# Altium project FlightController.PrjPcb (part 2 of 2)

## Sheet PSU.SchDoc
size A3; SheetNumber: 12; SheetTotal: 12
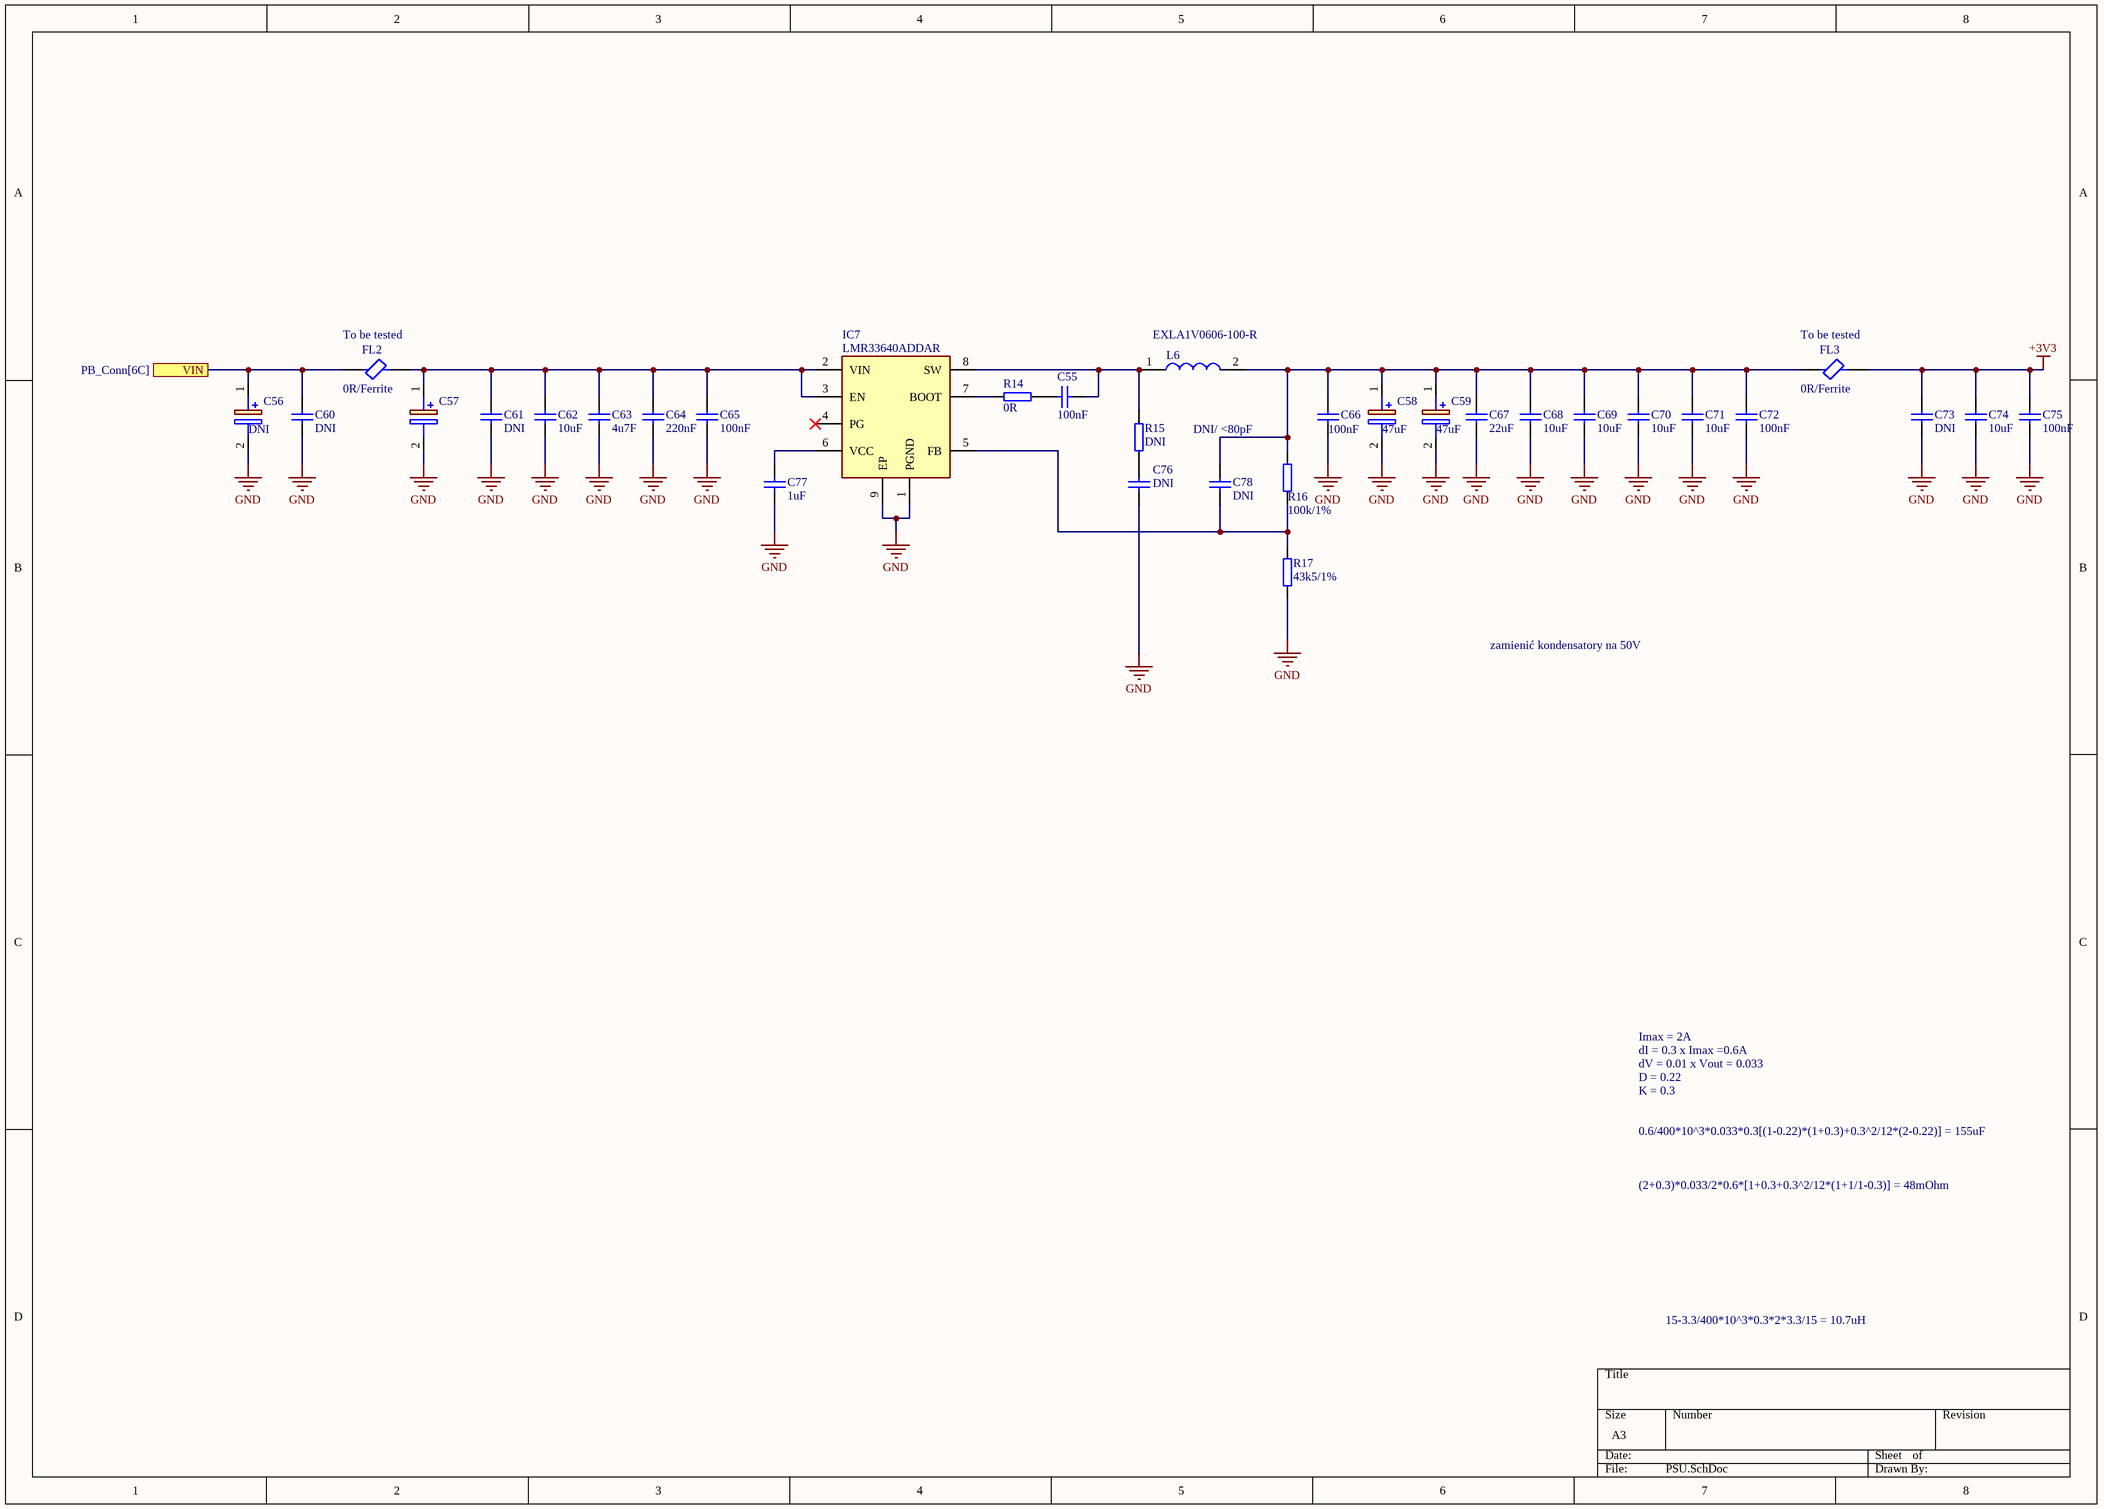
[diagram p12: PSU.SchDoc]

### Parts
(Parts that share a designator on the sheet are numbered #1, #2 ... from top to bottom, then left to right.)
C55  value 100nF  [CAP0402]  (hidden comment: Cap0402)
C56  value DNI  [CAPPM7343X310N]  (hidden comment: TR3D336K025D0200)
C57  TR3D336K025D0200  [CAPPM7343X310N]  (value not drawn)
C58  value 47uF  [CAPPC2012X90N]  (hidden comment: T58W9476M6R3C0200)
C59  value 47uF  [CAPPC2012X90N]  (hidden comment: T58W9476M6R3C0200)
C60  value DNI  [CAP0805]  (hidden comment: Cap0805)
C61  value DNI  [CAP0805]  (hidden comment: Cap0805)
C62  value 10uF  [CAP0805]  (hidden comment: Cap0805)
C63  value 4u7F  [CAP0805]  (hidden comment: Cap0805)
C64  value 220nF  [CAP0402]  (hidden comment: Cap0402)
C65  value 100nF  [CAP0402]  (hidden comment: Cap0402)
C66  value 100nF  [CAP0402]  (hidden comment: Cap0402)
C67  value 22uF  [CAP0805]  (hidden comment: Cap0805)
C68  value 10uF  [CAP0603]  (hidden comment: Cap0603)
C69  value 10uF  [CAP0603]  (hidden comment: Cap0603)
C70  value 10uF  [CAP0603]  (hidden comment: Cap0603)
C71  value 10uF  [CAP0603]  (hidden comment: Cap0603)
C72  value 100nF  [CAP0402]  (hidden comment: Cap0402)
C73  value DNI  [CAP0805]  (hidden comment: Cap0805)
C74  value 10uF  [CAP0603]  (hidden comment: Cap0603)
C75  value 100nF  [CAP0402]  (hidden comment: Cap0402)
C76  value DNI  [CAP0402]  (hidden comment: Cap0402)
C77  value 1uF  [CAP0402]  (hidden comment: Cap0402)
C78#2  value DNI  [CAP0402]  (hidden comment: Cap0402)
FL2  0R/Ferrite  [BLM31KN102BH1L]
FL3  0R/Ferrite  [BLM31KN102BH1L]
IC7  LMR33640ADDAR  [SOIC127P600X170-9N]
L6  EXLA1V0606-100-R  [EXLA1V0606100R]
R14  value 0R  [RES0402]  (hidden comment: Res0402)
R15  value DNI  [RES0402]  (hidden comment: Res0402)
R16  value 100k/1%  [RES0402]  (hidden comment: Res0402)
R17#2  value 43k5/1%  [RES0402]  (hidden comment: Res0402)

### Ports
VIN (see PB_Conn[6C])

### Nets
+3V3: C73.2 C74.2 C75.2 FL3.2
GND: C56.2(-) C57.2(-) C58.2(-) C59.2(-) C60.1 C61.1 C62.1 C63.1 C64.1 C65.1 C66.1 C67.1 C68.1 C69.1 C70.1 C71.1 C72.1 C73.1 C74.1 C75.1 C76.2 C77.1 IC7.1(PGND) IC7.9(EP) R17#2.1
VSYS: C56.1(+) C60.2 FL2.1 ; port VIN
NetC55_1: C55.1 R14.2
NetC55_2: C55.2 IC7.8(SW) L6.1 R15.1
NetC57_1: C57.1(+) C61.2 C62.2 C63.2 C64.2 C65.2 FL2.2 IC7.2(VIN) IC7.3(EN)
NetC58_1: C58.1(+) C59.1(+) C66.2 C67.2 C68.2 C69.2 C70.2 C71.2 C72.2 C78#2.2 FL3.1 L6.2 R16.2
NetC76_1: C76.1 R15.2
NetC77_2: C77.2 IC7.6(VCC)
NetC78#2_1: C78#2.1 IC7.5(FB) R16.1 R17#2.2
NetIC7_7: IC7.7(BOOT) R14.1

Not connected (* = marked no-connect by the designer): IC7 4(PG)*

### Notes on the sheet
- (near FL2) To be tested
- (near FL3) To be tested
- DNI/ <80pF
- zamienić kondensatory na 50V
- dI = 0.3 x Imax =0.6A
- Imax = 2A
- dV = 0.01 x Vout = 0.033
- K = 0.3
- D = 0.22
- 0.6/400*10^3*0.033*0.3[(1-0.22)*(1+0.3)+0.3^2/12*(2-0.22)] = 155uF
- (2+0.3)*0.033/2*0.6*[1+0.3+0.3^2/12*(1+1/1-0.3)] = 48mOhm
- 15-3.3/400*10^3*0.3*2*3.3/15 = 10.7uH

### Library data of the parts
C55 C66 C72 C75 = Cap0402: Voltage: 25V
C56 = TR3D336K025D0200: Capacitor Polarised; Voltage: DNI
C57 = TR3D336K025D0200: Capacitor Polarised; Manufacturer_Name: Vishay; Value: 33uF; Datasheet Link: http://www.vishay.com/doc?40080; Height: 3.1mm; Manufacturer_Part_Number: TR3D336K025D0200; Mouser Part Number: 74-TR3D336K025D0200; Mouser Price/Stock: https://www.mouser.com/Search/Refine.aspx?Keyword=74-TR3D336K025D0200
C58 C59 = T58W9476M6R3C0200: Capacitor Polarised; Voltage: 6V3
C60-C63 = Cap0805: Voltage: 35V
C64 C65 C77 = Cap0402: Voltage: 35V
C67 = Cap0805: Voltage: 25V
C68-C71 C74 = Cap0603: Voltage: 25V
FL2 FL3 = BLM31KN121SH1L: Filter
IC7 = LMR33640ADDAR: Integrated Circuit; Manufacturer_Name: Texas Instruments; Datasheet Link: https://www.ti.com/lit/gpn/LMR33640; Height: 1.7mm; Manufacturer_Part_Number: LMR33640ADDAR; Arrow Part Number: LMR33640ADDAR; Arrow Price/Stock: https://www.arrow.com/en/products/lmr33640addar/texas-instruments
L6 = EXLA1V0606-100-R: Inductor; Manufacturer_Name: Eaton; Datasheet Link: https://www.eaton.com/content/dam/eaton/products/electronic-components/resources/data-sheet/eaton-exla1v06-automotive-high-current-molded-inductor-data-sheet-elx1221-en.pdf; Height: 6mm; Manufacturer_Part_Number: EXLA1V0606-100-R; Mouser Part Number: 704-EXLA1V0606-100-R; Mouser Price/Stock: https://www.mouser.co.uk/ProductDetail/Bussmann-Eaton/EXLA1V0606-100-R?qs=T%252BzbugeAwjhRVU8Dylvhsg%3D%3D
C73 = Cap0805: Voltage: DNI
C76 C78#2 = Cap0402: Voltage: DNI

## Nets that join several sheets
+3V3: MCU (31 pins), TOF360 (6 pins), IMU (19 pins), RF (U1.1), NRF24l01 (10 pins), Flash (C78#1.2 IC8.8 R17#1.2), GPS (7 pins), Barometer (7 pins), LED (12 pins), PB_Conn (D13.1 J10.50), PSU (C73.2 C74.2 C75.2 FL3.2)
GND: MCU (45 pins), TOF360 (6 pins), IMU (35 pins), RF (U1.2), NRF24l01 (40 pins), Flash (C78#1.1 IC8.4), GPS (19 pins), Barometer (6 pins), LED (14 pins), PB_Conn (11 pins), PSU (25 pins)
BMS_CHRG_OK: MCU (IC4.93), PB_Conn (D12.1 J10.35)
BMS_OTG/VAP: MCU (IC4.87), PB_Conn (D12.2 J10.36)
BMS_PROCHOT: MCU (IC4.86), PB_Conn (D11.9 J10.34)
CB_ALERT: MCU (IC4.92), PB_Conn (D12.4 J10.37)
ESC_CLK: MCU (IC4.74), PB_Conn (D11.5 J10.30)
ESC_ENABLE: MCU (IC4.73), PB_Conn (D11.8 J10.33)
ESC_INHA1: MCU (IC4.10), PB_Conn (D6.1 J10.1)
ESC_INHA2: MCU (IC4.96), PB_Conn (D8.6 J10.7)
ESC_INHA3: MCU (IC4.81), PB_Conn (D9.4 J10.13)
ESC_INHA4: MCU (IC4.34), PB_Conn (D10.1 J10.19)
ESC_INHB1: MCU (IC4.11), PB_Conn (D8.1 J10.3)
ESC_INHB2: MCU (IC4.97), PB_Conn (D8.8 J10.9)
ESC_INHB3: MCU (IC4.82), PB_Conn (D9.6 J10.15)
ESC_INHB4: MCU (IC4.35), PB_Conn (D10.4 J10.21)
ESC_INHC1: MCU (IC4.12), PB_Conn (D8.4 J10.5)
ESC_INHC2: MCU (IC4.98), PB_Conn (D9.1 J10.11)
ESC_INHC3: MCU (IC4.85), PB_Conn (D9.8 J10.17)
ESC_INHC4: MCU (IC4.36), PB_Conn (D10.6 J10.23)
ESC_INLA1: MCU (IC4.56), PB_Conn (D7.1 J10.2)
ESC_INLA2: MCU (IC4.57), PB_Conn (D8.7 J10.8)
ESC_INLA3: MCU (IC4.58), PB_Conn (D9.5 J10.14)
ESC_INLA4: MCU (IC4.59), PB_Conn (D10.2 J10.20)
ESC_INLB1: MCU (IC4.60), PB_Conn (D8.2 J10.4)
ESC_INLB2: MCU (IC4.49), PB_Conn (D8.9 J10.10)
ESC_INLB3: MCU (IC4.50), PB_Conn (D9.7 J10.16)
ESC_INLB4: MCU (IC4.45), PB_Conn (D10.5 J10.22)
ESC_INLC1: MCU (IC4.65), PB_Conn (D8.5 J10.6)
ESC_INLC2: MCU (IC4.66), PB_Conn (D9.2 J10.12)
ESC_INLC3: MCU (IC4.67), PB_Conn (D9.9 J10.18)
ESC_INLC4: MCU (IC4.68), PB_Conn (D10.7 J10.24)
ESC_NFAULT: MCU (IC4.15), PB_Conn (D11.4 J10.29)
ESC_NSCS1: MCU (IC4.77), PB_Conn (D10.8 J10.25)
ESC_NSCS2: MCU (IC4.78), PB_Conn (D10.9 J10.26)
ESC_NSCS3: MCU (IC4.79), PB_Conn (D11.1 J10.27)
ESC_NSCS4: MCU (IC4.80), PB_Conn (D11.2 J10.28)
ESC_SDI: MCU (IC4.76), PB_Conn (D11.6 J10.31)
ESC_SDO: MCU (IC4.75), PB_Conn (D11.7 J10.32)
I2C1_SCL: MCU (IC4.136), TOF360 (6 pins)
I2C1_SDA: MCU (IC4.137), TOF360 (6 pins)
NetC86_2: MCU (IC4.101), GPS (C86.2 IC9.2)
NetC87_2: MCU (IC4.102), GPS (C87.2 IC9.3)
NetC88_2: MCU (IC4.99), GPS (C88.2 IC9.4)
NetIC1_5: MCU (IC4.125), IMU (IC1.5 R1.1)
NetIC1_6: MCU (IC4.118), IMU (IC1.6)
NetIC1_8: MCU (IC4.119), IMU (IC1.8 IC2.9 IC3.7)
NetIC2_4: MCU (IC4.2), IMU (IC2.4)
NetIC2_12: MCU (IC4.132), IMU (IC2.12)
NetIC3_1: MCU (IC4.22), IMU (IC3.1)
NetIC3_2: MCU (IC4.18), IMU (IC3.2)
NetIC4_5: MCU (IC4.5), LED (LED1.3)
NetIC4_26: MCU (IC4.26), LED (LED7.2)
NetIC4_27: MCU (IC4.27), LED (LED7.1)
NetIC4_42: MCU (IC4.42), Flash (IC8.7)
NetIC4_43: MCU (IC4.43), Flash (IC8.3)
NetIC4_46: MCU (IC4.46), Flash (IC8.2)
NetIC4_47: MCU (IC4.47), Flash (IC8.5)
NetIC4_48: MCU (IC4.48), Flash (IC8.6)
NetIC4_53: MCU (IC4.53), Barometer (IC10.7)
NetIC4_54: MCU (IC4.54), Barometer (IC10.2 R20#1.1)
NetIC4_55: MCU (IC4.55), Barometer (IC10.4 R19.1)
NetIC4_64: MCU (IC4.64), Flash (IC8.1 R17#1.1)
NetIC4_91: MCU (IC4.91), GPS (IC9.9)
NetIC4_100: MCU (IC4.100), GPS (IC9.5)
NetIC4_110: MCU (IC4.110), RF (U1.3), NRF24l01 (IC6.1)
NetIC4_111: MCU (IC4.111), RF (U1.5), NRF24l01 (IC6.3)
NetIC4_112: MCU (IC4.112), RF (U1.7), NRF24l01 (IC6.5)
NetIC4_113: MCU (IC4.113), RF (U1.6), NRF24l01 (IC6.4)
NetIC4_114: MCU (IC4.114), RF (U1.4), NRF24l01 (IC6.2)
NetIC4_115: MCU (IC4.115), RF (U1.8), NRF24l01 (IC6.6)
NetIC4_116: MCU (IC4.116), NRF24l01 (R11.1)
NetIC4_117: MCU (IC4.117), NRF24l01 (R12.1)
SCL: MCU (IC4.69), PB_Conn (D12.5 J10.38)
SDA: MCU (IC4.70), PB_Conn (D12.6 J10.39)
SPI1_MISO: MCU (IC4.124), IMU (IC1.4)
SPI1_MOSI: MCU (IC4.123), IMU (IC1.3)
SPI1_SCK: MCU (IC4.126), IMU (IC1.2)
SPI5_MISO: MCU (IC4.20), IMU (IC3.6)
SPI5_MOSI: MCU (IC4.21), IMU (IC3.5)
SPI5_SCK: MCU (IC4.19), IMU (IC3.3)
SPI6_MISO: MCU (IC4.127), IMU (IC2.1)
SPI6_MOSI: MCU (IC4.129), IMU (IC2.14)
SPI6_SCK: MCU (IC4.128), IMU (IC2.13)
TOF_EN: MCU (IC4.135), TOF360 (J3.6)
TOF_INT: MCU (IC4.28), PB_Conn (D12.7 J10.40)
TOF_INT: MCU (IC4.141), TOF360 (6 pins)
UDB_D+: MCU (IC4.104), PB_Conn (D12.8 J10.41)
UDB_D-: MCU (IC4.103), PB_Conn (D12.9 J10.42)
VSYS: PB_Conn (D14.1 J10.46 J10.47), PSU (C56.1 C60.2 FL2.1)